# Altium project PCB_Project.PrjPcb
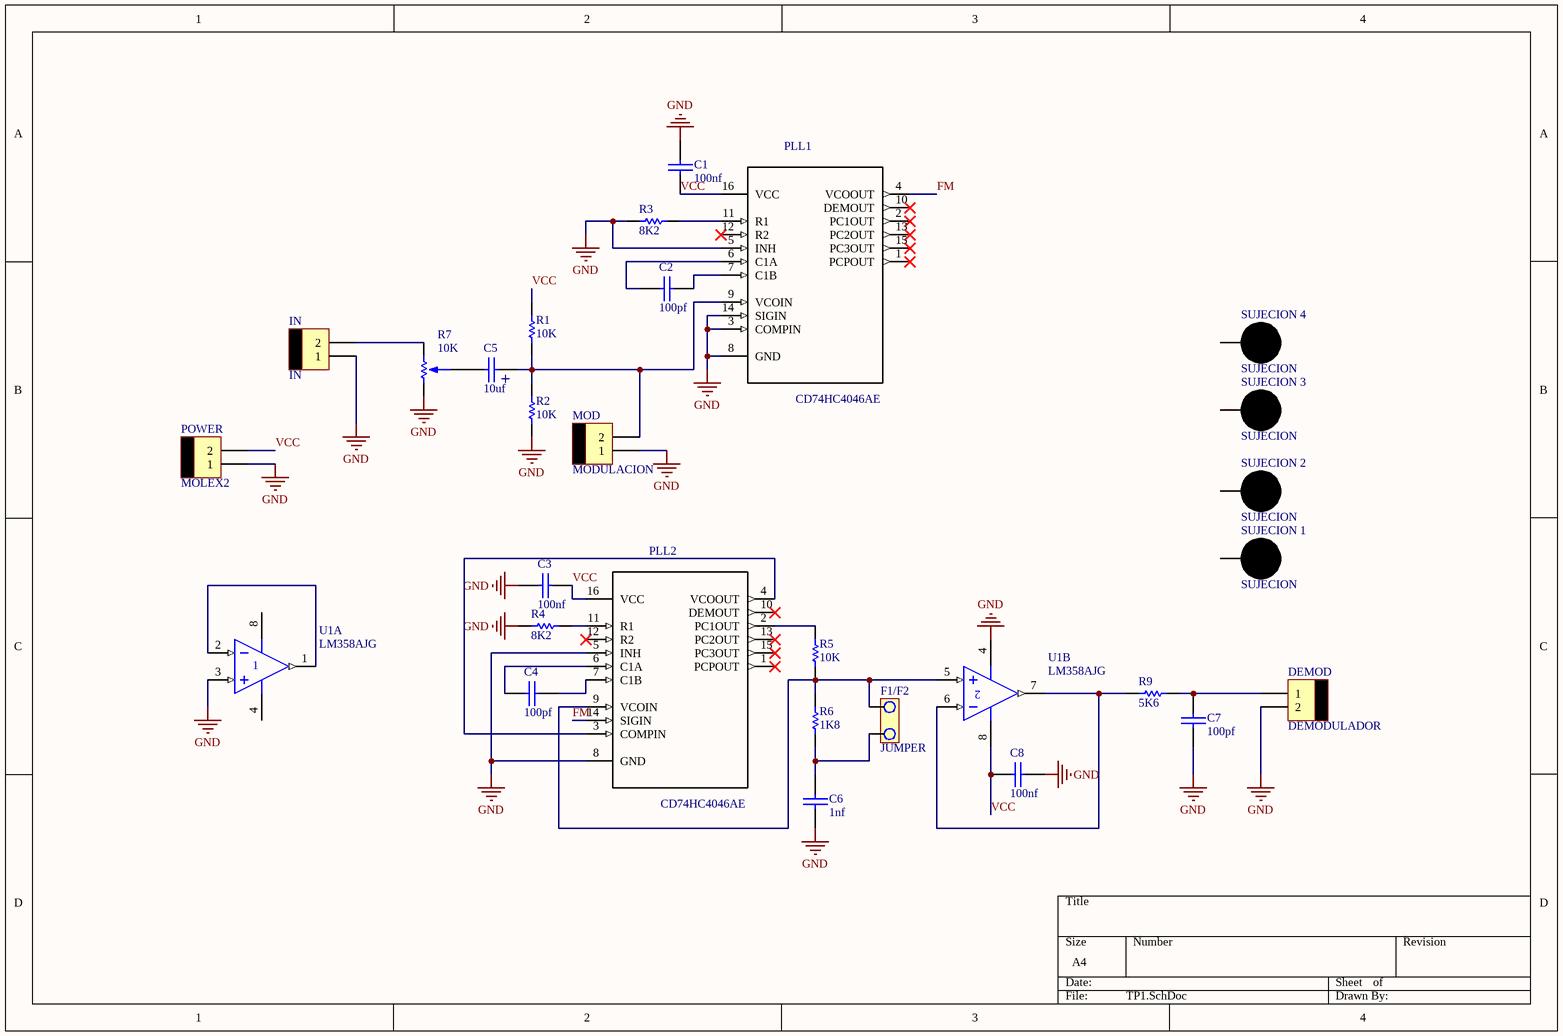
[diagram p0: TP1.SchDoc]
1 sheet, 28 parts. Net scope: global (net labels, ports and power ports of the same name join across sheets).
Board file: TP1.PcbDoc

## Sheet TP1.SchDoc
size A4

### Parts
C1  100nf  [CAP200]
C2  100pf  [CAP200]
C3  100nf  [CAP200]
C4  100pf  [CAP200]
C5  10uf  [CAP100RP]
C6  1nf  [CAP200]
C7  100pf  [CAP200]
C8  100nf  [CAP200]
DEMOD  DEMODULADOR  [MOLEX2]
F1/F2  JUMPER  [JUMPER2]
IN  IN  [MOLEX2]
MOD  MODULACION  [MOLEX2]
PLL1  CD74HC4046AE  [*DIP254P762X508-16]
PLL2  CD74HC4046AE  [*DIP254P762X508-16]
POWER  MOLEX2  [MOLEX2]
R1  10K  [RES400]
R2  10K  [RES400]
R3  8K2  [RES400]
R4  8K2  [RES400]
R5  10K  [RES400]
R6  1K8  [RES400]
R7  10K  [PRESET V]
R9  5K6  [RES400]
SUJECION_1  SUJECION  [SUJECION (5.00MM - 3.50MM)]
SUJECION_2  SUJECION  [SUJECION (5.00MM - 3.50MM)]
SUJECION_3  SUJECION  [SUJECION (5.00MM - 3.50MM)]
SUJECION_4  SUJECION  [SUJECION (5.00MM - 3.50MM)]
U1  LM358AJG  [JG008]  (parts A,B of 2)

### Nets
GND: C1.2 C3.1 C6.2 C7.2 C8.2 DEMOD.2 IN.1 MOD.1 PLL1.3(COMPIN) PLL1.5(INH) PLL1.8(GND) PLL1.14(SIGIN) PLL2.5(INH) PLL2.8(GND) POWER.1 R2.1 R3.1 R4.1 R7.3 U1.3(IN+) U1.4(V-)
FM: PLL1.4(VCOOUT) PLL2.14(SIGIN)
VCC: C1.1 C3.2 C8.1 PLL1.16(VCC) PLL2.16(VCC) POWER.2 R1.2 U1.8(V+)
NetC2_1: C2.1 PLL1.6(C1A)
NetC2_2: C2.2 PLL1.7(C1B)
NetC4_1: C4.1 PLL2.6(C1A)
NetC4_2: C4.2 PLL2.7(C1B)
NetC5_1: C5.1 MOD.2 PLL1.9(VCOIN) R1.1 R2.2
NetC5_2: C5.2 R7.2
NetC6_1: C6.1 F1/F2.1 R6.1
NetC7_1: C7.1 DEMOD.1 R9.2
NetF1/F2_2: F1/F2.2 PLL2.9(VCOIN) R5.1 R6.2 U1.5(IN+)
NetIN_2: IN.2 R7.1
NetPLL1_11: PLL1.11(R1) R3.2
NetPLL2_2: PLL2.2(PC1OUT) R5.2
NetPLL2_3: PLL2.3(COMPIN) PLL2.4(VCOOUT)
NetPLL2_11: PLL2.11(R1) R4.2
NetR9_1: R9.1 U1.6(IN-) U1.7(OUT)
NetU1_1: U1.1(OUT) U1.2(IN-)

Not connected (* = marked no-connect by the designer): PLL1 1(PCPOUT)* 2(PC1OUT)* 10(DEMOUT)* 12(R2)* 13(PC2OUT)* 15(PC3OUT)*; PLL2 1(PCPOUT)* 10(DEMOUT)* 12(R2)* 13(PC2OUT)* 15(PC3OUT)*; SUJECION_1 1; SUJECION_2 1; SUJECION_3 1; SUJECION_4 1

### Notes on the sheet
- (in symbol CAPPOL) +

### Library data of the parts
C1-C4 C6-C8 = CAP
C5 = CAPPOL
DEMOD IN MOD = MOLEX2
PLL1 PLL2 = CD74HC4046AE: MF: Texas Instruments; Package: DIP-16 Intersil; MP: CD74HC4046AE; Price: None; Availability: Unavailable; SnapEDA_Link: https://www.snapeda.com/parts/CD74HC4046AE/Texas%20Instruments/view-part/?ref=snap; Value: *
R1-R6 R9 = RES
R7 = PRESET
U1 = LM358AJG: Dual Operational Amplifier; Published: 15-Apr-2002; LatestRevisionDate: 04-Mar-2005; LatestRevisionNote: Stylized 3D Model Added.; DatasheetVersion: Aug-1988; PackageVersion: Jan-1995; PackageReference: JG008; Publisher: Altium Limited; PackageDescription: DIP; 8 Leads; Row Spacing 7.62 mm; Pitch 2.54 mm; ComponentLink1Description: Manufacturer Link; ComponentLink1URL: http://www.ti.com/